# Altium schematic sheet Comparator.SchDoc
size Letter; DocumentNumber: 3; SheetNumber: 3; SheetTotal: 7
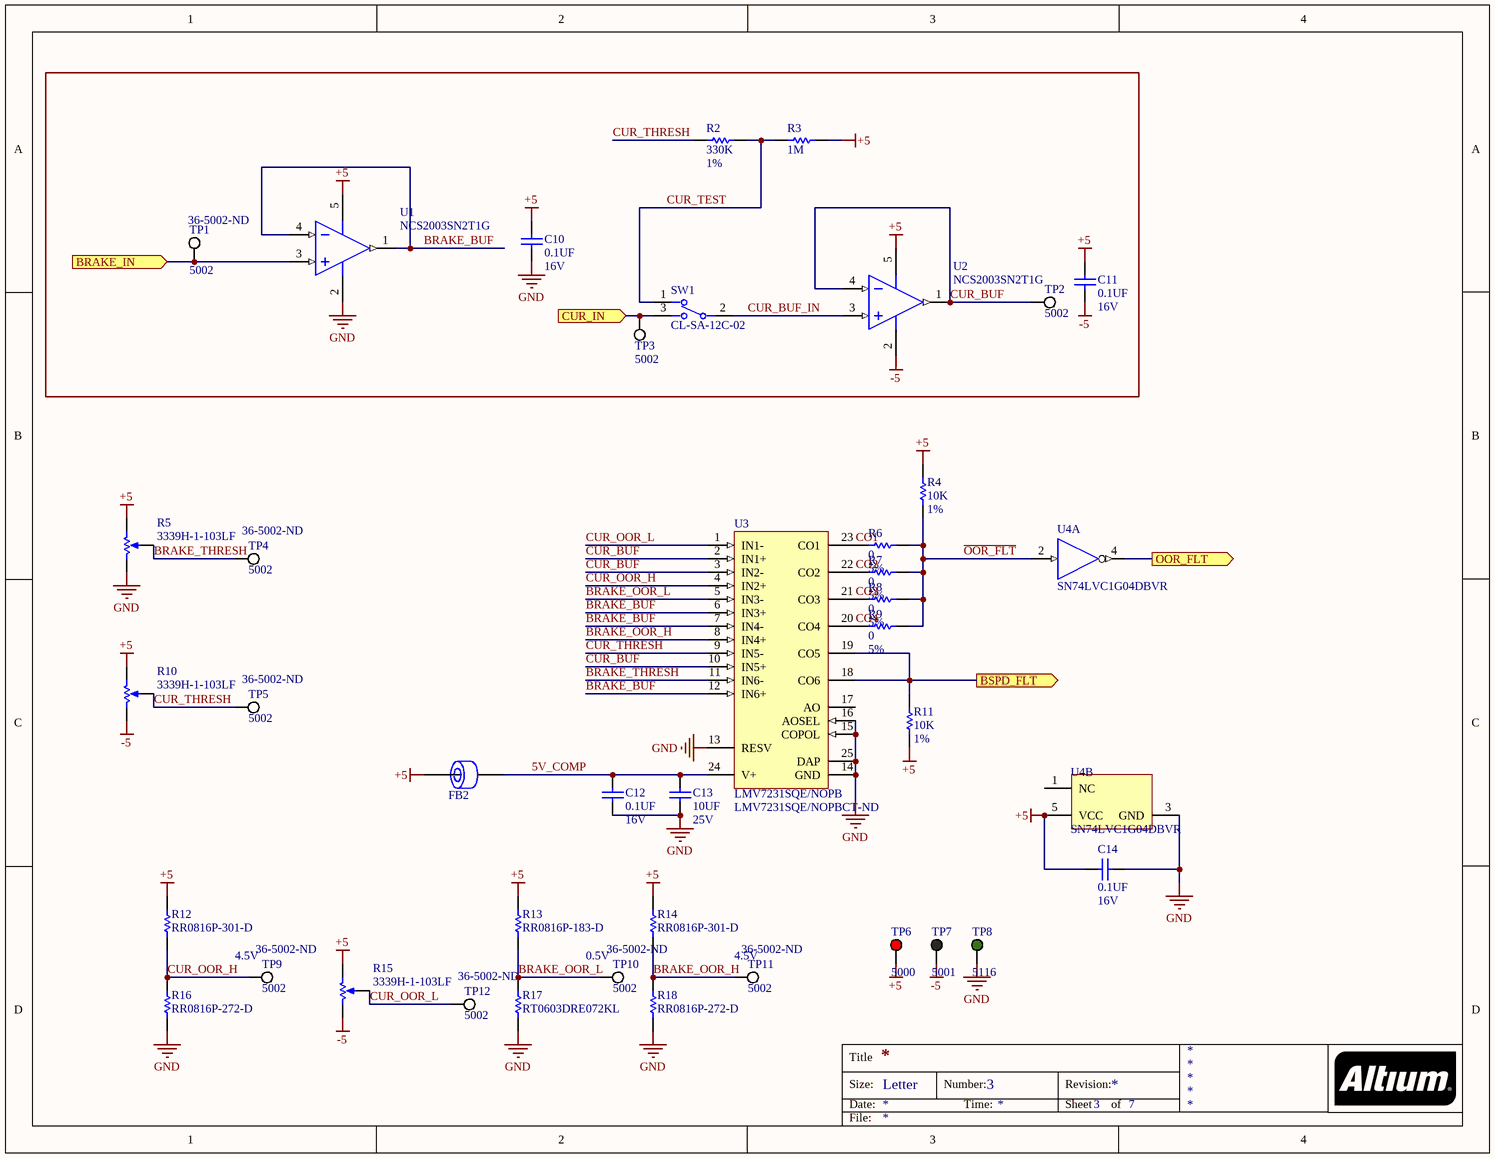
[diagram p0: Comparator.SchDoc]

## Parts
C10  Val: 0.1UF  Vol: 16V  [0603_CAP]  (hidden comment: CAP 0603 0.1UF 16V 10% X7R)
C11  Val: 0.1UF  Vol: 16V  [0603_CAP]  (hidden comment: CAP 0603 0.1UF 16V 10% X7R)
C12  Val: 0.1UF  Vol: 16V  [0603_CAP]  (hidden comment: CAP 0603 0.1UF 16V 10% X7R)
C13  Val: 10UF  Vol: 25V  [0603_CAP]  (hidden comment: CAP 0603 10UF 25V 20% X5R)
C14  Val: 0.1UF  Vol: 16V  [0603_CAP]  (hidden comment: CAP 0603 0.1UF 16V 10% X7R)
FB2  Ferrite Chip 120 Ohms  [0603]  (value not drawn)
R2  Val: 330K  Tol: 1%  [0603_RES]  (hidden comment: RES 0603 330K 1%)
R3  value 1M  [RESC2013X60X35ML10T20]  (hidden comment: RT0805BRE071ML)
R4  Val: 10K  Tol: 1%  [0603_RES]  (hidden comment: RES 0603 10K 1%)
R5  3339H-1-103LF  [3339H-1-103LF]
R6  Val: 0  Tol: 5%  [0603_RES]  (hidden comment: RES 0603 0 5%)
R7  Val: 0  Tol: 5%  [0603_RES]  (hidden comment: RES 0603 0 5%)
R8  Val: 0  Tol: 5%  [0603_RES]  (hidden comment: RES 0603 0 5%)
R9  Val: 0  Tol: 5%  [0603_RES]  (hidden comment: RES 0603 0 5%)
R10  3339H-1-103LF  [3339H-1-103LF]
R11  Val: 10K  Tol: 1%  [0603_RES]  (hidden comment: RES 0603 10K 1%)
R12  RR0816P-301-D  [RESC1608X50X30ML20T20]
R13  RR0816P-183-D  [RESC1608X50X30ML20T20]
R14  RR0816P-301-D  [RESC1608X50X30ML20T20]
R15  3339H-1-103LF  [3339H-1-103LF]
R16  RR0816P-272-D  [RESC1608X50X30NL20T20]
R17  RT0603DRE072KL  [RESC1608X55X25NL10T15]
R18  RR0816P-272-D  [RESC1608X50X30NL20T20]
SW1  CL-SA-12C-02  [CL-SA-12C-02]
TP1  5002  Supplier Part Number 1: 36-5002-ND  [KSTN-5002]
TP2  5002  [KSTN-5002]
TP3  5002  [KSTN-5002]
TP4  5002  Supplier Part Number 1: 36-5002-ND  [KSTN-5002]
TP5  5002  Supplier Part Number 1: 36-5002-ND  [KSTN-5002]
TP6  5000  [KSTN-5002]
TP7  5001  [KSTN-5002]
TP8  5116  [KSTN-5002]
TP9  5002  Supplier Part Number 1: 36-5002-ND  [KSTN-5002]
TP10  5002  Supplier Part Number 1: 36-5002-ND  [KSTN-5002]
TP11  5002  Supplier Part Number 1: 36-5002-ND  [KSTN-5002]
TP12  5002  Supplier Part Number 1: 36-5002-ND  [KSTN-5002]
U1  NCS2003SN2T1G  [ONSC-TSOP-5-483-02_V]
U2  NCS2003SN2T1G  [ONSC-TSOP-5-483-02_V]
U3  LMV7231SQE/NOPB  Supplier Part Number 1: LMV7231SQE/NOPBCT-ND  [RTW0024A_V]
U4  SN74LVC1G04DBVR  [DBV0005A_M]  (parts A,B of 2)

## Ports
BRAKE_IN (in), BSPD_FLT (out), CUR_IN (in), OOR_FLT (out)

## Nets
+5: C10.2 C11.2 C14.2 FB2.1 R3.2 R4.2 R5.1(CCW) R10.1(CCW) R11.1 R12.2 R13.2 R14.2 R15.1(CCW) TP6.1 U1.5(VDD) U2.5(VDD) U4.5(VCC)
-5: C11.1 R10.3(CW) R15.3(CW) TP7.1 U2.2(VSS)
GND: C10.1 C12.1 C13.1 C14.1 R5.3(CW) R16.1 R17.1 R18.1 TP8.1 U1.2(VSS) U3.13(RESV) U3.14(GND) U3.15(COPOL) U3.16(AOSEL) U3.25(DAP) U4.3(GND)
5V_COMP: C12.2 C13.2 FB2.2 U3.24(V+)
~{OOR_FLT}: R4.1 R6.2 R7.2 R8.2 R9.2 U4.2(A)
BRAKE_BUF: U1.1(VOUT) U1.4(IN-) U3.6(IN3+) U3.7(IN4-) U3.12(IN6+)
BRAKE_IN: TP1.1 U1.3(IN+) ; port BRAKE_IN
BRAKE_OOR_H: R14.1 R18.2 TP11.1 U3.8(IN4+)
BRAKE_OOR_L: R13.1 R17.2 TP10.1 U3.5(IN3-)
BRAKE_THRESH: R5.2(WIPER) TP4.1 U3.11(IN6-)
BSPD_FLT: R11.2 U3.18(CO6) U3.19(CO5) ; port BSPD_FLT
CO1: R6.1 U3.23(CO1)
CO2: R7.1 U3.22(CO2)
CO3: R8.1 U3.21(CO3)
CO4: R9.1 U3.20(CO4)
CUR_BUF: TP2.1 U2.1(VOUT) U2.4(IN-) U3.2(IN1+) U3.3(IN2-) U3.10(IN5+)
CUR_BUF_IN: SW1.2 U2.3(IN+)
CUR_IN: SW1.3 TP3.1 ; port CUR_IN
CUR_OOR_H: R12.1 R16.2 TP9.1 U3.4(IN2+)
CUR_OOR_L: R15.2(WIPER) TP12.1 U3.1(IN1-)
CUR_TEST: R2.2 R3.1 SW1.1
CUR_THRESH: R2.1 R10.2(WIPER) TP5.1 U3.9(IN5-)
OOR_FLT: U4.4(Y) ; port OOR_FLT

Not connected (* = marked no-connect by the designer): U3 17(AO); U4 1(NC)

## Notes on the sheet
- (near TP9) 4.5V
- (near TP10) 0.5V
- (near TP11) 4.5V
- Title
- Size:
- Date:
- Letter
- Number:
- Time:
- Revision:
- Sheet
- of
- File:

## Library data of the parts
C10-C12 C14 = CAP 0603 0.1UF 16V 10% X7R: Capacitor Surface Mount 0603 Footprint 0.1UF 16V 10% Tolerance Ceramic X7R; Manufacturer: Various; PCB Package: 0603; Description in Visual: Cap SMT 0603 0.1UF 16V 10%  Cer X7R; P/N: CAP 0603 0.1UF 16V 10% X7R; Manufacturer P/N: Various; Value: 0.1UF; Voltage: 16V; Tolerance: 10%; Type: Ceramic X7R; ComponentLink1Description: Manufacturer Website; ComponentLink2Description: Component Datasheet; ComponentLink3Description: Octopart Link
C13 = CAP 0603 10UF 25V 20% X5R: Capacitor Surface Mount 0603 Footprint 10UF 25V 20% Tolerance Ceramic X5R; Manufacturer: Various; PCB Package: 0603; Description in Visual: Cap SMT 0603 10UF 25V 20% Ceramic X5R; P/N: CAP 0603 10UF 25V 20% X5R; Manufacturer P/N: Various; Value: 10UF; Voltage: 25V; Tolerance: 20%; Type: Ceramic X5R; ComponentLink1Description: Manufacturer Website; ComponentLink2Description: Component Datasheet; ComponentLink3Description: Octopart Link
FB2 = MMZ1608S121A: Ferrite Chip 500 mA 120 Ohms Differential Mode - Single 0603 Footprint; Manufacturer: TDK; Description in Visual: Ferrite SMT 500mA 120Ohm Dif Mode 0603; Usage: Signal Line; Current (mA): 500; Frequency: 100 MHz; Impedance at Freq (ohms): 120; DC Resistance (ohms): 0.2; P/N: MMZ1608S121A; Manufacturer P/N: MMZ1608S121A; Filter type: Differential Mode - Single; Operating Temperature Range: -55 to +125 °C; PCB Package: 0603; ComponentLink1Description: Manufacturer Website; ComponentLink1URL: http://www.tdk.com/; ComponentLink2Description: Component Datasheet; ComponentLink2URL: http://www.tdk.co.jp/tefe02/e9412_mmz1608.pdf; ComponentLink3Description: Octopart Link; ComponentLink3URL: http://octopart.com/partsearch/#search/requestData&q=MMZ1608S121A
R2 = RES 0603 330K 1%: Resistor Surface Mount, 330K Ohms, 0603 Footprint, 1% Tolerance 0.1W; Manufacturer: Various; PCB Package: 0603; Description in Visual: Res SMT 330K 0603  1%  0.1W; P/N: RES 0603 330K 1%; Manufacturer P/N: Various; Value: 330K; Power_Rating: 0.1W; Tolerance: 1%
R3 = CMP-2001-01491-1: Manufacturer: Yageo; Part Number: RT0805BRE071ML
R4 R11 = RES 0603 10K 1%: Resistor Surface Mount, 10K Ohms, 0603 Footprint, 1% Tolerance 0.1W; Manufacturer: Various; PCB Package: 0603; Description in Visual: Res SMT 10K 0603  1%  0.1W; P/N: RES 0603 10K 1%; Manufacturer P/N: Various; Value: 10K; Power_Rating: 0.1W; Tolerance: 1%
R5 R10 R15 = 3339H-1-103LF: 10 kOhms 0.5W, 1/2W PC Pins Through Hole Trimmer Potentiometer Cermet 4 Turn Top Adjustment; ComponentLink2URL: https://www.ttelectronics.com/TTElectronics/media/ProductFiles/Trimmers/Datasheets/67.pdf; ComponentLink2Description: Datasheet; Supplier 1: Digi-Key; Supplier Part Number 1: 3339H-103LF-ND
R6-R9 = RES 0603 0 5%: Resistor Surface Mount, 0 Ohms, 0603 Footprint, 5% Tolerance 0.1W; Manufacturer: Various; PCB Package: 0603; Description in Visual: Res SMT 0 0603  5%  0.1W; Value: 0; P/N: RES 0603 0 5%; Manufacturer P/N: Various; Power_Rating: 0.1W; Tolerance: 5%
R12 R14 = CMP-2000-02599-1: Manufacturer: Susumu; Part Number: RR0816P-301-D
R13 = CMP-2000-02514-1: Manufacturer: Susumu; Part Number: RR0816P-183-D
R16 R18 = CMP-2000-02579-1: Manufacturer: Susumu; Part Number: RR0816P-272-D
R17 = CMP-2000-04621-1: Manufacturer: Yageo; Part Number: RT0603DRE072KL
SW1 = CL-SA-12C-02: Slide Switch SPDT Through Hole; Supplier 1: Digi-Key; Supplier Part Number 1: 563-1388-ND
TP1-TP5 TP9-TP12 = 5002: Test Point, White, 1-Pin THD, RoHS, Bulk; Manufacturer: KeystoneElectronics; Outside Diameter: 2.54mm; Plating: Silver; Mounting Hole Size: 1mm; Product: TestPoints; Packaging: Bulk; Manufacturer URL: http://www.keyelco.com/; Length: 7.62mm; Datasheet Version: Rev. G, 12/2008; Type: Miniature; Product Category: CircuitBoardHardware-PCB; Material: Nylon; RoHS: True; Contact Material: PhosphorBronze; Datasheet URL: https://ciiva.com/datasheet-click-2917627?src=ciiva&sig=bd195616; Color: White; Brand: KeystoneElectronics; Supplier 1: Digi-Key
  TP2 TP3: Supplier Part Number 1: 36-5002-ND
TP6 = 5000: Test Point, Red, 1-Pin THD, RoHS, Bulk; Manufacturer: KeystoneElectronics; Outside Diameter: 2.54mm; Plating: Silver; Mounting Hole Size: 1mm; Product: TestPoints; Packaging: Bulk; Manufacturer URL: http://www.keyelco.com/; Length: 7.62mm; Datasheet Version: Rev. G, 12/2008; Type: Miniature; Product Category: CircuitBoardHardware-PCB; Material: Nylon; RoHS: True; Contact Material: PhosphorBronze; Datasheet URL: https://ciiva.com/datasheet-click-2917627?src=ciiva&sig=bd195616; Color: Red; Brand: KeystoneElectronics; Supplier 1: Digi-Key; Supplier Part Number 1: 36-5000-ND
TP7 = 5001: Test Point, Black, 1-Pin THD, RoHS, Bulk; Manufacturer: KeystoneElectronics; Outside Diameter: 2.54mm; Plating: Silver; Mounting Hole Size: 1mm; Product: TestPoints; Packaging: Bulk; Manufacturer URL: http://www.keyelco.com/; Length: 7.62mm; Datasheet Version: Rev. G, 12/2008; Type: Miniature; Product Category: CircuitBoardHardware-PCB; Material: Nylon; RoHS: True; Contact Material: PhosphorBronze; Datasheet URL: https://ciiva.com/datasheet-click-2917627?src=ciiva&sig=bd195616; Color: Red; Brand: KeystoneElectronics; Supplier 1: Digi-Key; Supplier Part Number 1: 36-5001-ND
TP8 = 5116: Test Point, Green, 1-Pin THD, RoHS, Bulk; Manufacturer: KeystoneElectronics; Outside Diameter: 2.54mm; Plating: Silver; Mounting Hole Size: 1mm; Product: TestPoints; Packaging: Bulk; Manufacturer URL: http://www.keyelco.com/; Length: 7.62mm; Datasheet Version: Rev. G, 12/2008; Type: Miniature; Product Category: CircuitBoardHardware-PCB; Material: Nylon; RoHS: True; Contact Material: PhosphorBronze; Datasheet URL: https://ciiva.com/datasheet-click-2917627?src=ciiva&sig=bd195616; Color: Red; Brand: KeystoneElectronics; Supplier 1: Digi-Key; Supplier Part Number 1: 36-5116-ND
U1 U2 = CMP-1310-00381-1: Low Voltage, Rail-to-Rail Output Operational Amplifier, 1.7 to 5.5 V, -40 to 85 degC, 5-Pin TSOP, Pb-Free, Tape and Reel; Manufacturer: On Semiconductor; VCC Max (V): 5.5; VCC Min (V): 1.7; ComponentLink3URL: http://www.onsemi.com/pub_link/Collateral/483.PDF; Packing: Tape and Reel; ComponentLink1URL: http://www.onsemi.com/; PackageReference: TSOP-5-483-02; Mounting Technology: Surface Mount; PackageVersion: Rev. K, 04/2013; PartNumber: NCS2003SN2T1G; DatasheetVersion: Rev. 3; ComponentLink2URL: http://www.onsemi.cn/pub_link/Collateral/NCS2003-D.PDF; ComponentLink2Description: Datasheet; ComponentLink3Description: Package Specification; RoHS: TRUE; PackageDescription: 5-Pin Small Outline Package, Body 3 x 1.5 mm, Pitch 0.95 mm; ComponentLink1Description: Manufacturer URL
U3 = LMV7231SQE/NOPB: Hex Window Comparator with 1.5% Precision and 400mV Reference, 24-pin LLP, 250 Reel; Manufacturer: Texas Instruments; PowerWise: N; PackageTopMarking: NS*UZXYTT*L7231SQ; Code_JEDEC: MO-220-WGGD-6; PinCount: 24; ComponentLink1Description: Datasheet URL; PackageDescription: LLP, Plastic, Quad, 4 x 4 x 0.8mm Body, 24 Lead, 0.5mm Pitch, No Pullback; PackageReference: RTW0024A; CompType: Comparator; RoHS: Y; ComponentLink1URL: http://www.ti.com/general/docs/lit/getliterature.tsp?genericPartNumber=LMV7231&fileType=pdf; Supplier 1: Digi-Key
U4 = CMP-0859-00134-3: Single Inverter, DBV0005A, LARGE T&R; Manufacturer: Texas Instruments; 3-State Output: No; Sub-Family: Inverting Buffer/Driver; Logic: Inverting; Rating: Catalog; VCC(Max)(V): 5.5; ICC @ Nom Voltage(Max)(mA): 0.01; Output Type: CMOS; Output Drive (IOL/IOH)(Max)(mA): 32/-32; tpd @ Nom Voltage(Max)(ns): 7.5,5.2,4.2,3.7; Technology Family: LVC; Input Type: CMOS/TTL; Bits(#): 1; F @ Nom Voltage(Max)(Mhz): 150; VCC(Min)(V): 1.65; Voltage(Nom)(V): 1.8,2.5,3.3,5; DatasheetVersion: SCES214AD; Schmitt Trigger: No; Operating Temperature Range(C): -40 to 125,-40 to 85; PackageReference: DBV0005A; Generic Part Number: SN74LVC1G04